# Altium schematic sheet Power.SchDoc
size A4
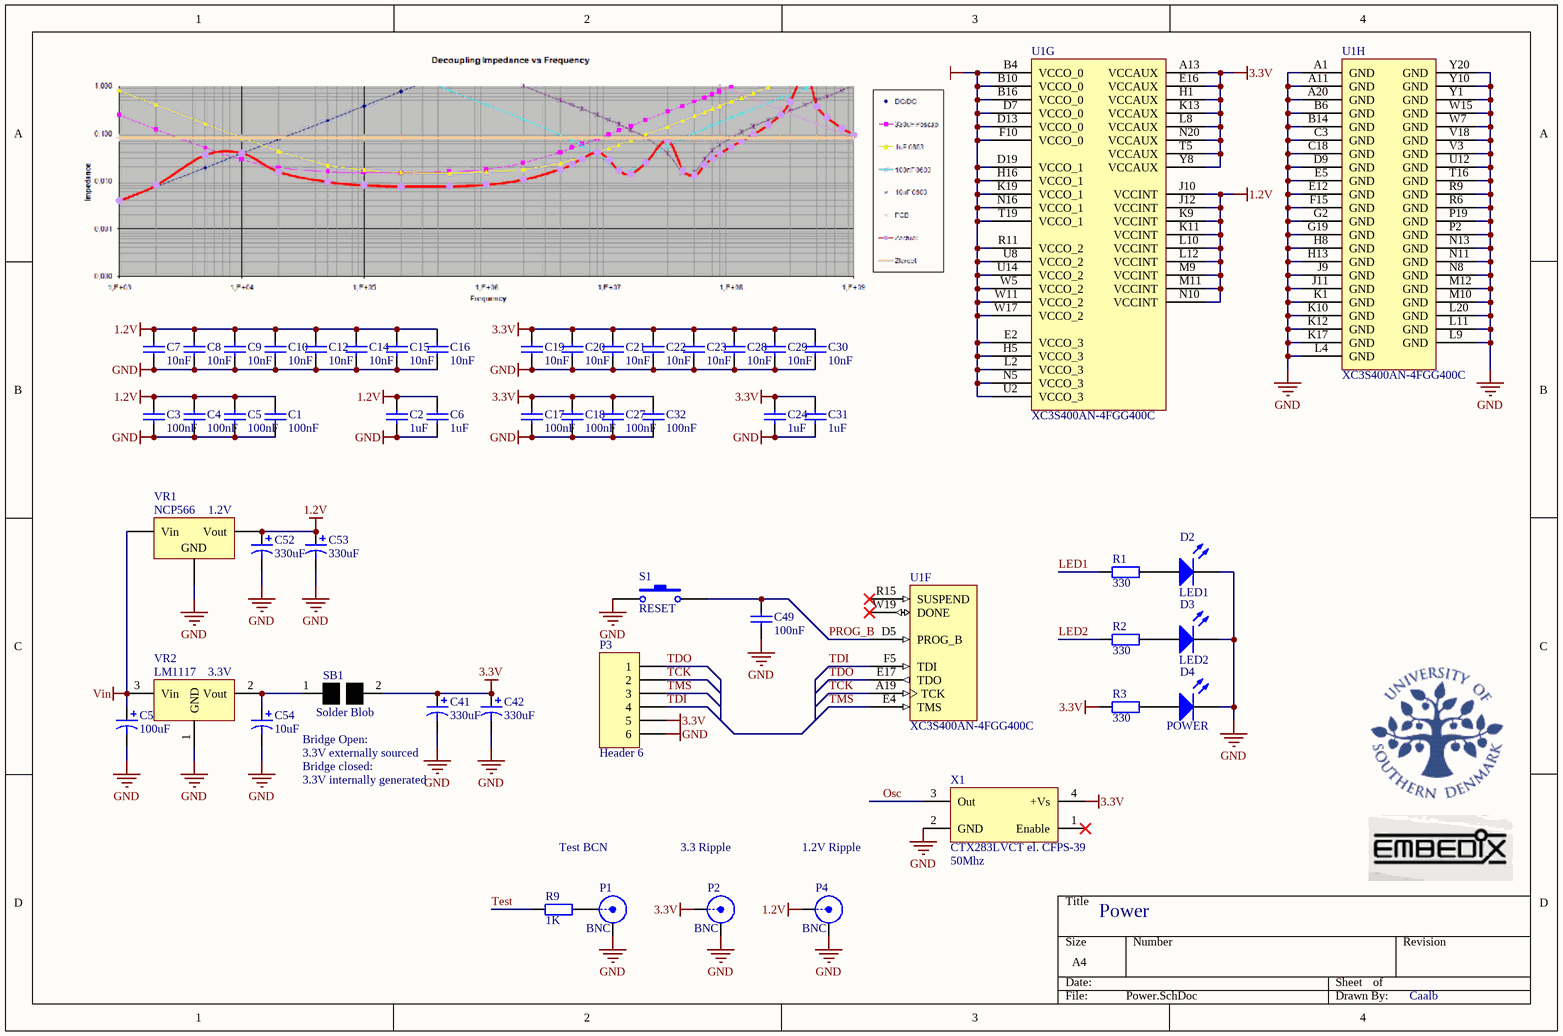
[diagram p0: Power.SchDoc]

## Parts
C1  value 100nF  [0603]  (hidden comment: Cap)
C2  value 1uF  [0603]  (hidden comment: Cap)
C3  value 100nF  [0603]  (hidden comment: Cap)
C4  value 100nF  [0603]  (hidden comment: Cap)
C5  value 100nF  [0603]  (hidden comment: Cap)
C6  value 1uF  [0603]  (hidden comment: Cap)
C7  value 10nF  [0603]  (hidden comment: Cap)
C8  value 10nF  [0603]  (hidden comment: Cap)
C9  value 10nF  [0603]  (hidden comment: Cap)
C10  value 10nF  [0603]  (hidden comment: Cap)
C12  value 10nF  [0603]  (hidden comment: Cap)
C14  value 10nF  [0603]  (hidden comment: Cap)
C15  value 10nF  [0603]  (hidden comment: Cap)
C16  value 10nF  [0603]  (hidden comment: Cap)
C17  value 100nF  [0603]  (hidden comment: Cap)
C18  value 100nF  [0603]  (hidden comment: Cap)
C19  value 10nF  [0603]  (hidden comment: Cap)
C20  value 10nF  [0603]  (hidden comment: Cap)
C21  value 10nF  [0603]  (hidden comment: Cap)
C22  value 10nF  [0603]  (hidden comment: Cap)
C23  value 10nF  [0603]  (hidden comment: Cap)
C24  value 1uF  [0603]  (hidden comment: Cap)
C27  value 100nF  [0603]  (hidden comment: Cap)
C28  value 10nF  [0603]  (hidden comment: Cap)
C29  value 10nF  [0603]  (hidden comment: Cap)
C30  value 10nF  [0603]  (hidden comment: Cap)
C31  value 1uF  [0603]  (hidden comment: Cap)
C32  value 100nF  [0603]  (hidden comment: Cap)
C41  value 330uF  [Tantal size X]  (hidden comment: Cap Pol1)
C42  value 330uF  [Tantal size X]  (hidden comment: Cap Pol1)
C49  value 100nF  [0603]  (hidden comment: Cap)
C51  value 100uF  [Tantal size X]  (hidden comment: Cap Pol1)
C52  value 330uF  [Tantal size X]  (hidden comment: Cap Pol1)
C53  value 330uF  [Tantal size X]  (hidden comment: Cap Pol1)
C54  value 10uF  [1206Pol]  (hidden comment: Cap Pol1)
D2  LED1  [LED0805]
D3  LED2  [LED0805]
D4  POWER  [LED0805]
P1  BNC  [Miniature Coaxial Connectors]
P2  BNC  [Miniature Coaxial Connectors]
P3  Header 6  [HDR1X6]
P4  BNC  [Miniature Coaxial Connectors]
R1  value 330  [0805]  (hidden comment: Res2)
R2  value 330  [0805]  (hidden comment: Res2)
R3  value 330  [0805]  (hidden comment: Res2)
R9  value 1K  [0603]  (hidden comment: Res2)
S1  RESET  [B3U-3000P]
SB1  Solder Blob  [0805 v.solder_blob]
U1  XC3S400AN-4FGG400C  [FGG400]  (parts F,G,H of 8)
VR1  NCP566  value 1.2V  [SOT-223]
VR2  LM1117  value 3.3V  [SOT-223]
X1  CTX283LVCT el. CFPS-39  value 50Mhz  [CB3LV-3C-50M0000]

## Nets
1.2V: C1.2 C2.2 C3.2 C4.2 C5.2 C6.2 C7.2 C8.2 C9.2 C10.2 C12.2 C14.2 C15.2 C16.2 C52.1 C53.1 P4.1(X) U1.J10(VCCINT) U1.J12(VCCINT) U1.K9(VCCINT) U1.K11(VCCINT) U1.L10(VCCINT) U1.L12(VCCINT) U1.M9(VCCINT) U1.M11(VCCINT) U1.N10(VCCINT) VR1.3(Vout)
3.3V: C17.2 C18.2 C19.2 C20.2 C21.2 C22.2 C23.2 C24.2 C27.2 C28.2 C29.2 C30.2 C31.2 C32.2 C41.1 C42.1 P2.1(X) P3.5 R3.2 SB1.2 U1.A13(VCCAUX) U1.B4(VCCO_0) U1.B10(VCCO_0) U1.B16(VCCO_0) U1.D7(VCCO_0) U1.D13(VCCO_0) U1.D19(VCCO_1) U1.E2(VCCO_3) U1.E16(VCCAUX) U1.F10(VCCO_0) U1.H1(VCCAUX) U1.H5(VCCO_3) U1.H16(VCCO_1) U1.K13(VCCAUX) U1.K19(VCCO_1) U1.L2(VCCO_3) U1.L8(VCCAUX) U1.N5(VCCO_3) U1.N16(VCCO_1) U1.N20(VCCAUX) U1.R11(VCCO_2) U1.T5(VCCAUX) U1.T19(VCCO_1) U1.U2(VCCO_3) U1.U8(VCCO_2) U1.U14(VCCO_2) U1.W5(VCCO_2) U1.W11(VCCO_2) U1.W17(VCCO_2) U1.Y8(VCCAUX) X1.4(+Vs)
GND: C1.1 C2.1 C3.1 C4.1 C5.1 C6.1 C7.1 C8.1 C9.1 C10.1 C12.1 C14.1 C15.1 C16.1 C17.1 C18.1 C19.1 C20.1 C21.1 C22.1 C23.1 C24.1 C27.1 C28.1 C29.1 C30.1 C31.1 C32.1 C41.2 C42.2 C49.1 C51.2 C52.2 C53.2 C54.2 D2.2(K) D3.2(K) D4.2(K) P1.2(Y) P2.2(Y) P3.6 P4.2(Y) S1.1 U1.A1(GND) U1.A11(GND) U1.A20(GND) U1.B6(GND) U1.B14(GND) U1.C3(GND) U1.C18(GND) U1.D9(GND) U1.E5(GND) U1.E12(GND) U1.F15(GND) U1.G2(GND) U1.G19(GND) U1.H8(GND) U1.H13(GND) U1.J9(GND) U1.J11(GND) U1.K1(GND) U1.K10(GND) U1.K12(GND) U1.K17(GND) U1.L4(GND) U1.L9(GND) U1.L11(GND) U1.L20(GND) U1.M10(GND) U1.M12(GND) U1.N8(GND) U1.N11(GND) U1.N13(GND) U1.P2(GND) U1.P19(GND) U1.R6(GND) U1.R9(GND) U1.T16(GND) U1.U12(GND) U1.V3(GND) U1.V18(GND) U1.W7(GND) U1.W15(GND) U1.Y1(GND) U1.Y10(GND) U1.Y20(GND) VR1.2(GND) VR2.1(GND) X1.2(GND)
Vin: C51.1 VR1.1(Vin) VR2.3(Vin)
LED1: R1.2
LED2: R2.2
Osc: X1.3(Out)
PROG_B: C49.2 S1.2 U1.D5(PROG_B)
TCK: P3.2 U1.A19(TCK)
TDI: P3.4 U1.F5(TDI)
TDO: P3.1 U1.E17(TDO)
Test: R9.1
TMS: P3.3 U1.E4(TMS)
NetC54_1: C54.1 SB1.1 VR2.2(Vout)
NetD2_1: D2.1(A) R1.1
NetD3_1: D3.1(A) R2.1
NetD4_1: D4.1(A) R3.1
NetP1_1: P1.1(X) R9.2

Not connected (* = marked no-connect by the designer): U1 R15(SUSPEND)* W19(DONE)*; X1 1(Enable)*

## Notes on the sheet
- Test BCN
- 3.3 Ripple
- 1.2V Ripple
- Power
- Caalb
- (in symbol Jumper) Bridge Open:; 3.3V externally sourced; Bridge closed:; 3.3V internally generated

## Library data of the parts
C1-C10 C12 C14-C24 C27-C32 C49 = Cap: !Capacitor; Published: 8-Jun-2000; LatestRevisionDate: 17-Jul-2002; LatestRevisionNote: Re-released for DXP Platform.; PackageReference: RAD-0.3; Publisher: Altium Limited
C41 C42 C51-C54 = Cap Pol1: !Polarized Capacitor (Radial); Published: 8-Jun-2000; LatestRevisionDate: 17-Jul-2002; LatestRevisionNote: Re-released for DXP Platform.; PackageReference: RB7.6-15; Publisher: Altium Limited
D2 = LED0: LED; Value: Red; Published: 8-Jun-2000; LatestRevisionDate: 08-Jul-2005; LatestRevisionNote: Mech Layer 1 removed.; PackageReference: RD; Publisher: Altium Limited
D3 = LED0: LED; Value: Yellow; Published: 8-Jun-2000; LatestRevisionDate: 08-Jul-2005; LatestRevisionNote: Mech Layer 1 removed.; PackageReference: GR; Publisher: Altium Limited
D4 = LED0: LED; Value: Green; Published: 8-Jun-2000; LatestRevisionDate: 08-Jul-2005; LatestRevisionNote: Mech Layer 1 removed.; PackageReference: YE; Publisher: Altium Limited
P1 P2 P4 = BNC: Miniature Coaxial Connectors; LatestRevisionDate: 17-Jul-2002; LatestRevisionNote: Re-released for DXP Platform.; Publisher: Altium Limited
P3 = Header 6: Header, 6-Pin; LatestRevisionDate: 17-Jul-2002; LatestRevisionNote: Re-released for DXP Platform.; Publisher: Altium Limited
R1-R3 R9 = Res2: !Resistor; Published: 8-Jun-2000; Publisher: Altium Limited
  R1-R3: LatestRevisionDate: 17-Jul-2002; LatestRevisionNote: Re-released for DXP Platform.; PackageReference: AXIAL-0.4
  R9: Revision: July-2002: Re-released for DXP Platform.
S1 = SW-PB: Switch; Published: 24-Mar-1999; LatestRevisionDate: 17-Jul-2002; LatestRevisionNote: Re-released for DXP Platform.; PackageReference: SPST-2; Publisher: Altium Limited
SB1 = Jumper
U1 = XC3S400AN-4FGG400C: Spartan-3AN Non-Volatile FPGA, 311 User I/Os, 400-Pin FBGA, Standard Performance, Commercial Grade, Pb-Free; Published: 20-Jul-2007; DatasheetVersion: 26-Feb-2007; PackageVersion: ver1.0, Mar-2005; PackageReference: FGG400; Publisher: Altium Limited; PackageDescription: 400-Ball Fine Pitch Ball Grid Array 1.00 mm Pitch (FGG400) - Pb-Free; Code_JEDEC: MS-034-AAH-1; Code_IPC: BGA100P20X20-400; ComponentLink1Description: Manufacturer Link; ComponentLink1URL: http://www.xilinx.com/products/silicon_solutions/fpgas/spartan_series/spartan3an_fpgas/index.htm; ComponentLink2Description: Datasheet; ComponentLink2URL: http://direct.xilinx.com/bvdocs/publications/ds557.pdf
VR1 = Volt Reg: Volt Reg NCP566; Published: 24-Mar-1999; LatestRevisionDate: 17-Jul-2002; LatestRevisionNote: Re-released for DXP Platform.; PackageReference: D2PAK; Publisher: Altium Limited; Code_JEDEC: SMD-220
VR2 = LM1117: 800mA Low-Dropout Linear Regulator
X1 = CFPS-39: 3.3V, ultra minature surface mount oscillator